# Altium project ESP8266to32.PrjPcb
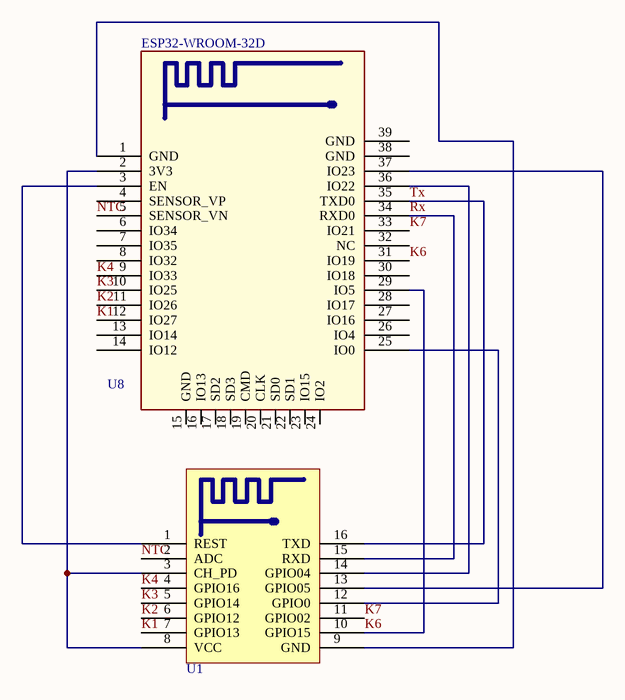
[diagram p0: ESP8266to32.SchDoc]
1 sheet, 2 parts. Net scope: global (net labels, ports and power ports of the same name join across sheets).
Board file: ESP8266to32-2.PcbDoc

## Sheet ESP8266to32.SchDoc
size A4

### Parts
U1  ESP-8266  [ESP_12E]  (value not drawn)
U8  ESP32-WROOM-32D  [esp32 WROOM-L]

### Nets
K1: U1.7(GPIO13) U8.12(IO27)
K2: U1.6(GPIO12) U8.11(IO26)
K3: U1.5(GPIO14) U8.10(IO25)
K4: U1.4(GPIO16) U8.9(IO33)
K6: U1.10(GPIO15) U8.29(IO5) U8.31(IO19)
K7: U1.11(GPIO02) U8.33(IO21)
NTC: U1.2(ADC) U8.5(SENSOR_VN)
Rx: U1.15(RXD) U8.34(RXD0)
Tx: U1.16(TXD) U8.35(TXD0)
NetU1_1: U1.1(REST) U8.3(EN)
NetU1_3: U1.3(CH_PD) U1.8(VCC) U8.2(3V3)
NetU1_9: U1.9(GND) U8.1(GND)
NetU1_12: U1.12(GPIO0) U8.25(IO0)
NetU1_13: U1.13(GPIO05) U8.37(IO23)
NetU1_14: U1.14(GPIO04) U8.36(IO22)

Not connected (* = marked no-connect by the designer): U8 4(SENSOR_VP) 6(IO34) 7(IO35) 8(IO32) 13(IO14) 14(IO12) 15(GND) 16(IO13) 17(SD2) 18(SD3) 19(CMD) 20(CLK) 21(SD0) 22(SD1) 23(IO15) 24(IO2) 26(IO4) 27(IO16) 28(IO17) 30(IO18) 32(NC) 38(GND) 39(GND)

### Library data of the parts
U8 = ESP32-WROOM-32D: IC: SoC; GPIO, I2C, I2S, IR, SD, SDIO, SPI, UART; 2.7Ã·3.6VDC; 20dBm; MF: Espressif Systems; Package: Module Espressif Systems; Price: None; Availability: Unavailable; MP: ESP32-WROOM-32D; SnapEDA_Link: https://www.snapeda.com/parts/ESP32-WROOM-32D/Espressif%20Systems/view-part/?ref=snap; Value: *